# Altium project riglab_dynamic_scales_wifi_3ch.PrjPcb (part 1 of 2)
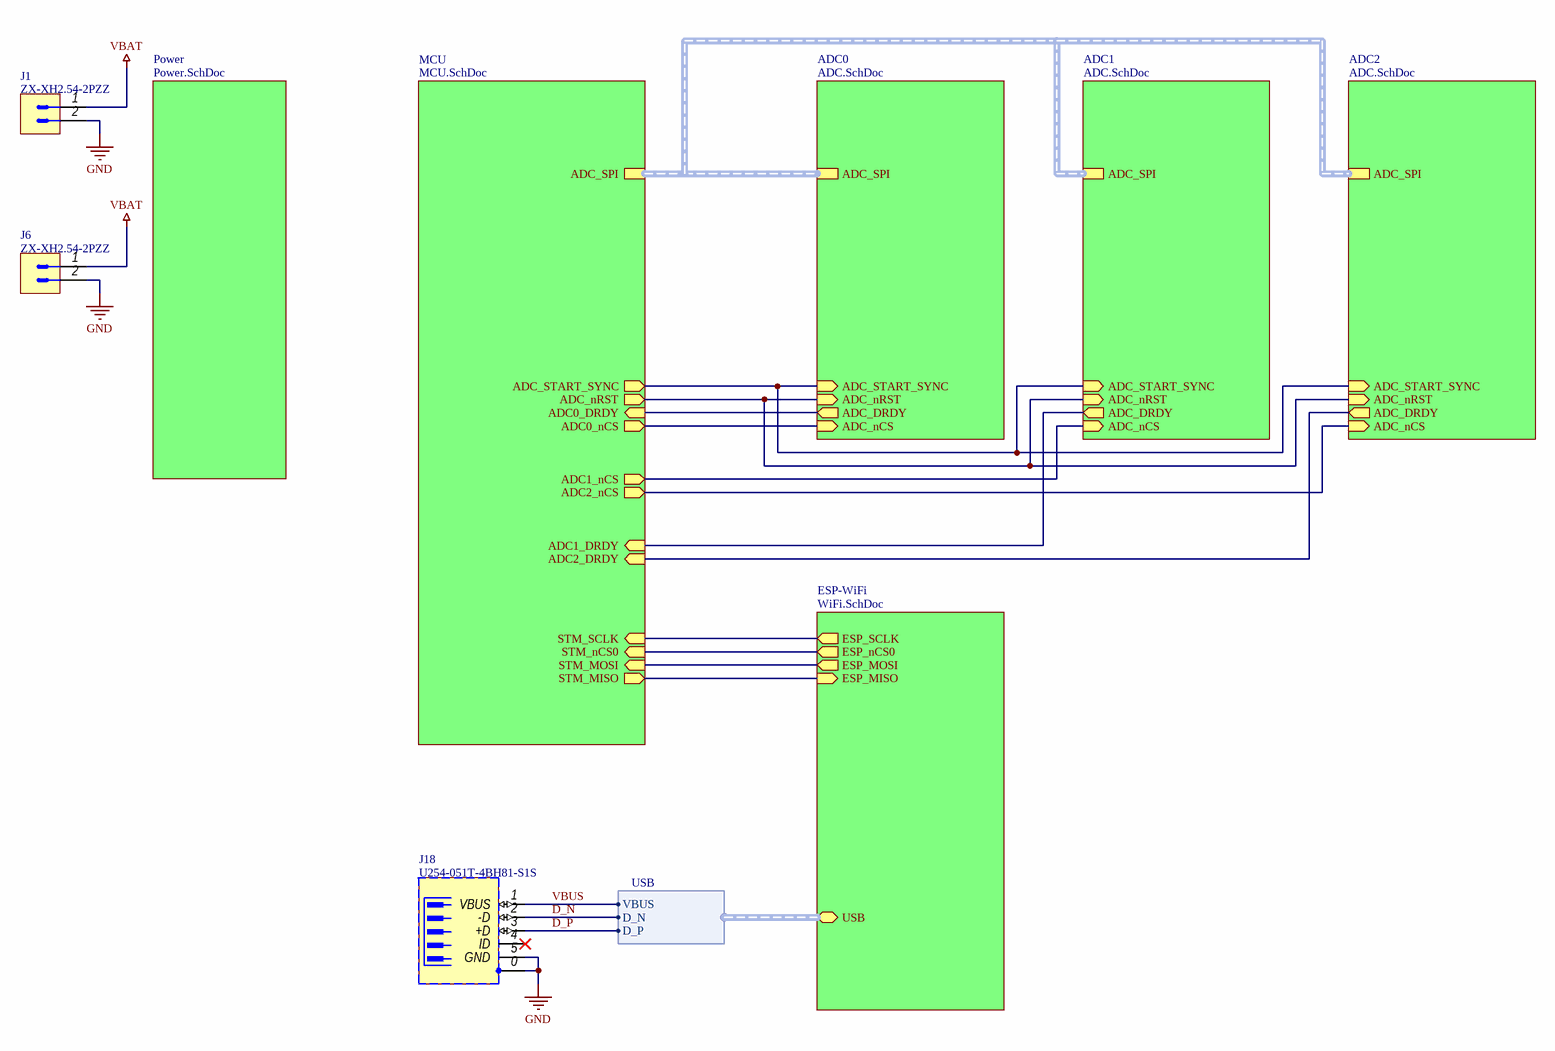
[diagram p0: Main.SchDoc]
Title: riglab_dynamic_scales_wifi_3ch; Project_Name: riglab_dynamic_scales_wifi_3ch; ProjectName: riglab_dynamic_scales_wifi_3ch; Project: riglab_dynamic_scales_wifi_3ch; Company_Name: RIGLAB-XYZ; BoardName: riglab_dynamic_scales_wifi_3ch; Author: Vitaliy Krepak
5 sheets, 252 parts. Net scope: hierarchical (ports join the sheet entries above them; power ports are global).
Board file: riglab_dynamic_scales_wifi_3ch .PcbDoc
Sheets:
  Main.SchDoc
    Power = Power.SchDoc
    MCU = MCU.SchDoc
    ESP-WiFi = WiFi.SchDoc
    ADC0 = ADC.SchDoc
    ADC1 = ADC.SchDoc
    ADC2 = ADC.SchDoc

## Sheet Main.SchDoc: riglab_dynamic_scales_wifi_3ch
size 420 x 297 mm; DocumentNumber: 1; SheetNumber: 1; SheetTotal: 5; Обозначение_Код: RIG-00.00.001 Э3; Наименование1: Аппаратный модуль; Наименование3: РИГЛАБ; Наименование_организации: ООО "Риглаб"; п_Разраб_Р: Крепак В.; Вид_документа_SCH: Схема электрическая принципиальная; Дата_Разраб: 31.10.2025

### Parts
J1  ZX-XH2.54-2PZZ  [XH2.54-2PZZ]
J6  ZX-XH2.54-2PZZ  [XH2.54-2PZZ]
J18  U254-051T-4BH81-S1S  [U254-051T-4BH81-S1S]

### Sub-sheets
ADC0 = ADC.SchDoc: ADC_nRST (in), ADC_START_SYNC (in), ADC_nCS (in), ADC_DRDY (out), ADC_SPI (harness ADC_SPI)
ADC1 = ADC.SchDoc: ADC_nRST (in), ADC_START_SYNC (in), ADC_nCS (in), ADC_DRDY (out), ADC_SPI (harness ADC_SPI)
ADC2 = ADC.SchDoc: ADC_nRST (in), ADC_START_SYNC (in), ADC_nCS (in), ADC_DRDY (out), ADC_SPI (harness ADC_SPI)
ESP-WiFi = WiFi.SchDoc: ESP_SCLK (out), ESP_nCS0 (out), ESP_MOSI (out), ESP_MISO (in), USB (bidir, harness USB)
MCU = MCU.SchDoc: STM_SCLK (in), STM_nCS0 (in), STM_MOSI (in), STM_MISO (out), ADC_nRST (out), ADC_START_SYNC (out), ADC0_nCS (out), ADC0_DRDY (in), ADC_SPI (harness ADC_SPI), ADC1_nCS (out), ADC2_nCS (out), ADC1_DRDY (in), ADC2_DRDY (in)
Power = Power.SchDoc: no entries

### Harnesses
USB: D_N, D_P, VBUS

### Nets
GND: J1.2 J6.2 J18.0(SH) J18.5(GND)
VBAT: J1.1 J6.1
VBUS: J18.1(VBUS) ; sheet ESP-WiFi/USB.VBUS
ADC0_DRDY: sheet MCU/ADC0_DRDY, sheet ADC0/ADC_DRDY
ADC0_nCS: sheet MCU/ADC0_nCS, sheet ADC0/ADC_nCS
ADC1_DRDY: sheet MCU/ADC1_DRDY, sheet ADC1/ADC_DRDY
ADC1_nCS: sheet MCU/ADC1_nCS, sheet ADC1/ADC_nCS
ADC2_DRDY: sheet MCU/ADC2_DRDY, sheet ADC2/ADC_DRDY
ADC2_nCS: sheet MCU/ADC2_nCS, sheet ADC2/ADC_nCS
ADC_nRST: sheet MCU/ADC_nRST, sheet ADC0/ADC_nRST, sheet ADC1/ADC_nRST, sheet ADC2/ADC_nRST
ADC_START_SYNC: sheet MCU/ADC_START_SYNC, sheet ADC0/ADC_START_SYNC, sheet ADC1/ADC_START_SYNC, sheet ADC2/ADC_START_SYNC
D_N: J18.2(-D) ; sheet ESP-WiFi/USB.D_N
D_P: J18.3(+D) ; sheet ESP-WiFi/USB.D_P
ESP_CS0: sheet MCU/STM_nCS0, sheet ESP-WiFi/ESP_nCS0
ESP_MISO: sheet MCU/STM_MISO, sheet ESP-WiFi/ESP_MISO
ESP_MOSI: sheet MCU/STM_MOSI, sheet ESP-WiFi/ESP_MOSI
ESP_SCLK: sheet MCU/STM_SCLK, sheet ESP-WiFi/ESP_SCLK

Not connected (* = marked no-connect by the designer): J18 4(ID)*

### Buses and harness runs
harness sheet ADC0/ADC_SPI = sheet ADC1/ADC_SPI = sheet ADC2/ADC_SPI = sheet MCU/ADC_SPI

### Notes on the sheet
- Перв. примен.
- Справ. №
- Подп. дата
- Инв. № дубл.
- Взам. инв. №
- Подп. и дата
- Изм.
- Разраб.
- Лист
- № докум.
- Подп.
- Дата
- Лит.
- Масса
- Масштаб
- Пров.
- Т.контр.
- Листов
- Инв. № подл.
- Н.контр.
- Утв.
- ALTIUM GOSTBOM2.0 KEV
- Файл:
- Копировал
- Формат А3

### Library data of the parts
J1 J6 = ZX-XH2.54-2PZZ: 1x2P XH 1 2.54mm Tin Male pin 2 260℃ -25℃~+85℃ Brass 3A Straight Plugin,P=2.54mm Wire To Board / Wire To Wire Connector ROHS; ID: 48; Table: Connectors - Общ; Part Number: ZX-XH2.54-2PZZ; Device: ZX-XH2.54-2PZZ; Type: Connector; SMD: No; Status: Active; Price: 0; Price2: 0; Price3: 0; Author: Krepak V.; CreateDate: 19.02.2024
J18 = U254-051T-4BH81-S1S: USB 2.0 1.8A 1 260℃ Surface Mount，Right Angle 5P Female -40℃~+85℃ Gold Copper Alloy Micro-B SMD USB Connectors ROHS; ID: 34; Table: Connectors - Интерфейсы; Part Number: U254-051T-4BH81-S1S; Device: U254-051T-4BH81-S1S; Series: U254-051T-4BH81-S1S; Type: Connector; Price: 0; Price2: 0; Price3: 0; Author: Krepak V.; CreateDate: 09.04.2024

## Sheet Power.SchDoc: riglab_dynamic_scales_wifi_3ch
size 420 x 297 mm; DocumentNumber: 2; SheetNumber: 2; SheetTotal: 5; Обозначение_Код: RIG-00.00.001 Э3
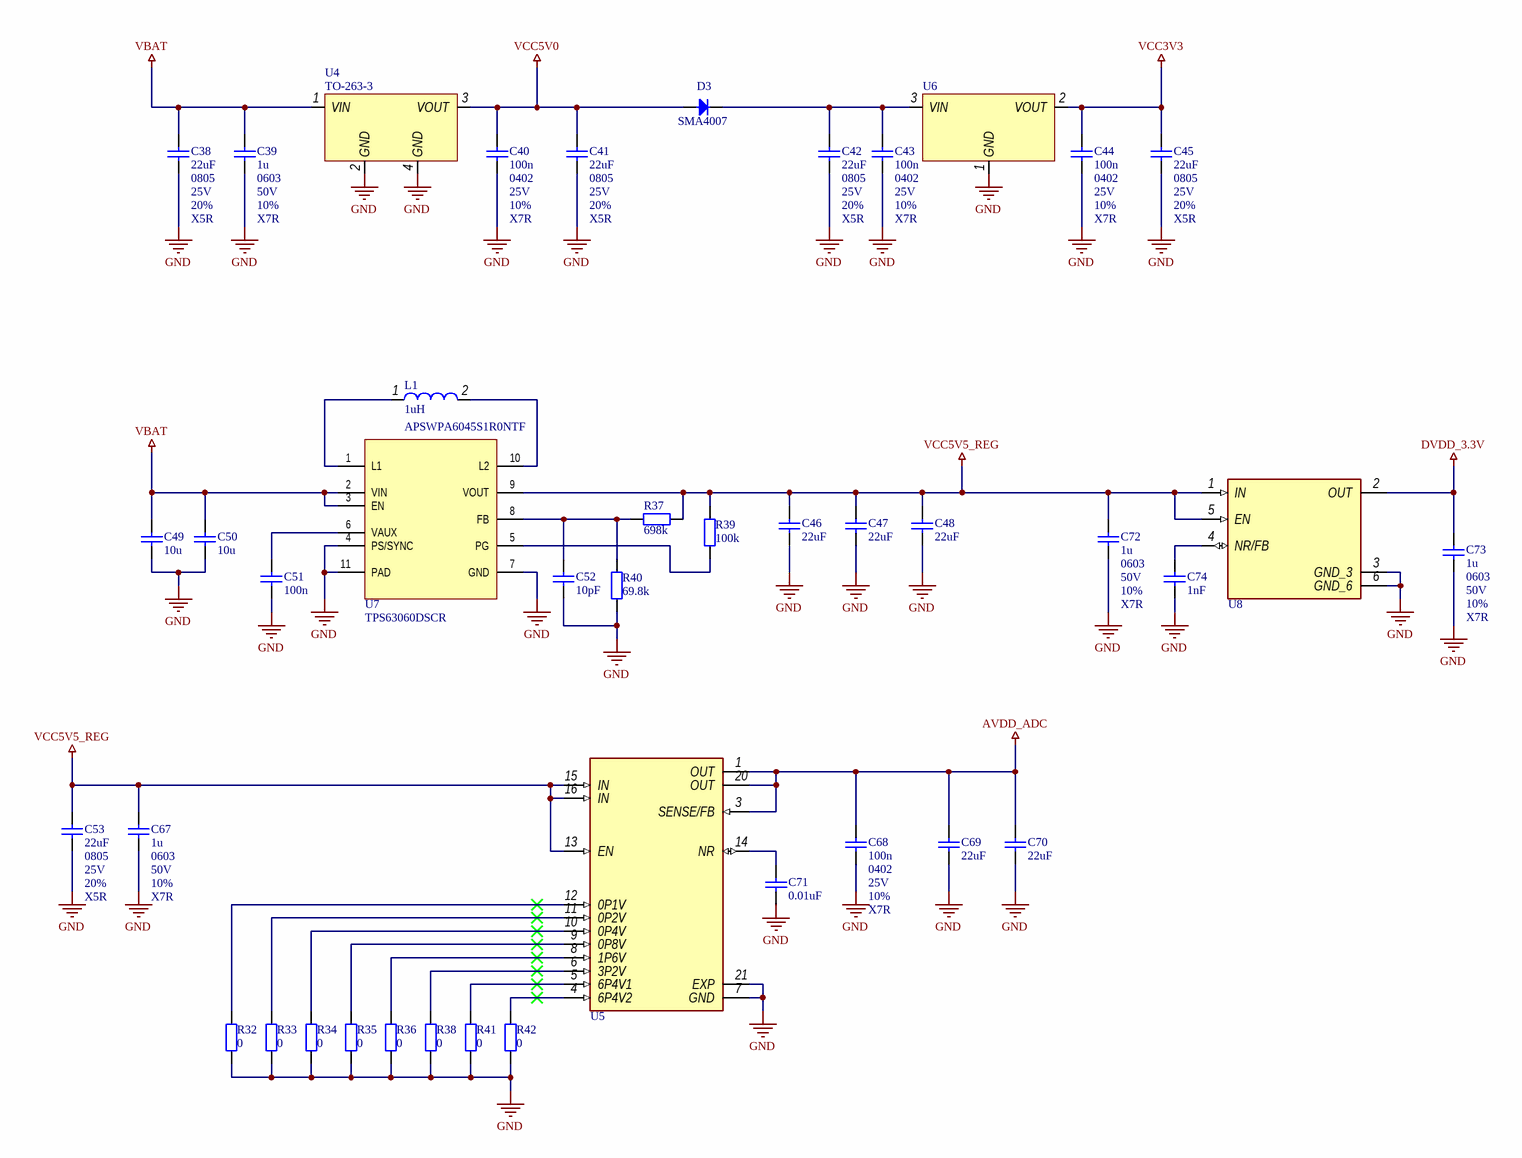
[diagram p1: Power.SchDoc]

### Parts
C38  22uF  Device: 0805  Voltage: 25V  Tolerance: 20%  Dielectric Type: X5R  [CAPC2012X135N]
C39  1u  Device: 0603  Voltage: 50V  Tolerance: 10%  Dielectric Type: X7R  [CAPC1608X85N]
C40  100n  Device: 0402  Voltage: 25V  Tolerance: 10%  Dielectric Type: X7R  [CAPC1005X55N]
C41  22uF  Device: 0805  Voltage: 25V  Tolerance: 20%  Dielectric Type: X5R  [CAPC2012X135N]
C42  22uF  Device: 0805  Voltage: 25V  Tolerance: 20%  Dielectric Type: X5R  [CAPC2012X135N]
C43  100n  Device: 0402  Voltage: 25V  Tolerance: 10%  Dielectric Type: X7R  [CAPC1005X55N]
C44  100n  Device: 0402  Voltage: 25V  Tolerance: 10%  Dielectric Type: X7R  [CAPC1005X55N]
C45  22uF  Device: 0805  Voltage: 25V  Tolerance: 20%  Dielectric Type: X5R  [CAPC2012X135N]
C46  22uF  [CAPC2012X135N]
C47  22uF  [CAPC2012X135N]
C48  22uF  [CAPC2012X135N]
C49  10u  [CAPC2012X135N]
C50  10u  [CAPC2012X135N]
C51  100n  [CAPC1005X55N]
C52  10pF  [CAPC1005X55N]
C53  22uF  Device: 0805  Voltage: 25V  Tolerance: 20%  Dielectric Type: X5R  [CAPC2012X135N]
C67  1u  Device: 0603  Voltage: 50V  Tolerance: 10%  Dielectric Type: X7R  [CAPC1608X85N]
C68  100n  Device: 0402  Voltage: 25V  Tolerance: 10%  Dielectric Type: X7R  [CAPC1005X55N]
C69  22uF  [CAPC2012X135N]
C70  22uF  [CAPC2012X135N]
C71  0.01uF  [CAPC1005X55N]
C72  1u  Device: 0603  Voltage: 50V  Tolerance: 10%  Dielectric Type: X7R  [CAPC1608X85N]
C73  1u  Device: 0603  Voltage: 50V  Tolerance: 10%  Dielectric Type: X7R  [CAPC1608X85N]
C74  1nF  [CAPC1005X55N]
D3  SMA4007  [DO-214AC]
L1  1uH  Part Number: APSWPA6045S1R0NTF  [APSWPA6045]
R32  0  [RESC1608X50N]
R33  0  [RESC1608X50N]
R34  0  [RESC1608X50N]
R35  0  [RESC1608X50N]
R36  0  [RESC1608X50N]
R37  698k  [RESC1005X40N]
R38  0  [RESC1608X50N]
R39  100k  [RESC1005X40N]
R40  69.8k  [RESC1005X40N]
R41  0  [RESC1608X50N]
R42  0  [RESC1608X50N]
U4  value TO-263-3  [TO-263-3_L8.6-W10.2-P2.54-LS14.4-BR]  (hidden comment: LM7805S)
U5  TPS7A4700RGWR  [QFN65P500X500X100-21N]  (value not drawn)
U6  AMS1117-3.3  [SOT230P700-4BN]  (value not drawn)
U7  TPS63060DSCR  [WSON10]
U8  TPS73733DCQR  [IC_TPS73733DCQR]  (value not drawn)

### Nets
AVDD_ADC: C68.2 C69.2 C70.2 U5.1(OUT) U5.3(SENSE/FB) U5.20(OUT)
DVDD_3.3V: C73.2 U8.2(OUT)
GND: C38.1 C39.1 C40.1 C41.1 C42.1 C43.1 C44.1 C45.1 C46.1 C47.1 C48.1 C49.1 C50.1 C51.1 C52.1 C53.1 C67.1 C68.1 C69.1 C70.1 C71.1 C72.1 C73.1 C74.1 R32.1 R33.1 R34.1 R35.1 R36.1 R38.1 R40.1 R41.1 R42.1 U4.2(GND) U4.4(GND) U5.7(GND) U5.21(EXP) U6.1(GND) U7.4(PS/SYNC) U7.7(GND) U7.11(PAD) U8.3(GND_3) U8.6(GND_6)
VBAT: C38.2 C39.2 C49.2 C50.2 U4.1(VIN) U7.2(VIN) U7.3(EN)
VCC3V3: C44.2 C45.2 U6.2(VOUT)
VCC5V0: C40.2 C41.2 D3.1(A) U4.3(VOUT)
VCC5V5_REG: C46.2 C47.2 C48.2 C53.2 C67.2 C72.2 R37.2 R39.2 U5.13(EN) U5.15(IN) U5.16(IN) U7.9(VOUT) U8.1(IN) U8.5(EN)
NetC42_2: C42.2 C43.2 D3.2(C) U6.3(VIN)
NetC51_2: C51.2 U7.6(VAUX)
NetC52_2: C52.2 R37.1 R40.2 U7.8(FB)
NetC71_2: C71.2 U5.14(NR)
NetC74_2: C74.2 U8.4(NR/FB)
NetL1_1: L1.1 U7.1(L1)
NetL1_2: L1.2 U7.10(L2)
NetR32_2: R32.2 U5.12(0P1V)
NetR33_2: R33.2 U5.11(0P2V)
NetR34_2: R34.2 U5.10(0P4V)
NetR35_2: R35.2 U5.9(0P8V)
NetR36_2: R36.2 U5.8(1P6V)
NetR38_2: R38.2 U5.6(3P2V)
NetR39_1: R39.1 U7.5(PG)
NetR41_2: R41.2 U5.5(6P4V1)
NetR42_2: R42.2 U5.4(6P4V2)

### Notes on the sheet
- Подп. дата
- Инв. № дубл.
- Взам. инв. №
- Подп. и дата
- Инв. № подл.
- Изм.
- Лист
- № докум.
- Подп.
- Дата
- ALTIUM GOSTBOM2.0 KEV
- Файл:
- Копировал
- Формат А3

### Library data of the parts
C38 C41 C42 C45 C53 = GRM21BR61E226ME44L: CAP CER 0805 22uF 25V X5R; Manufacturer: Murata; ID: 21; Type: Resistor; Packaging Type: Cut Tape; Working Temperature Min: -55°С; Working Temperature Max: +125°С; Table: Capacitor SMT - Керамические; Part Number: GRM21BR61E226ME44L; Value: 22uF; Series: GRM; SMD: Yes; Manufacturer Part Number: GRM21BR61E226ME44L; Datasheet URL: #https://www.terraelectronica.ru/pdf/show?pdf_file=http%253A%252F%252Fwww.farnell.com%252Fdatasheets%252F2048737.pdf#; Status: Active; Price: 0; Price2: 0; Price3: 0; Author: Arshanitsa D.; CreateDate: 17.08.2020
C39 C67 C72 C73 = CC0603KRX7R9BB105: CAP CER 0603 1u 50V X7R; Manufacturer: Yageo; ID: 12; Type: Resistor; Packaging Type: Cut Tape; Working Temperature Min: -55°С; Working Temperature Max: +125°С; Table: Capacitor SMT - Керамические; Part Number: CC0603KRX7R9BB105; Value: 1u; Series: CC; SMD: Yes; Manufacturer Part Number: CC0603KRX7R9BB105; Datasheet URL: #https://www.terraelectronica.ru/pdf/show?pdf_file=http%253A%252F%252Fwww.mouser.com%252Fds%252F2%252F447%252FUPY-GPHC_X7R_6.3V-to-50V_18-1154002.pdf#; Status: Active; Price: 0; Price2: 0; Price3: 0; Author: Krepak V.; CreateDate: 06.04.2020
C40 C43 C44 C68 = GRM155R71E104KE14D: CAP CER 0402 100n 25V X7R; Manufacturer: Murata; ID: 4; Type: Resistor; Packaging Type: Cut Tape; Working Temperature Min: -55°С; Working Temperature Max: +125°С; Table: Capacitor SMT - Керамические; Part Number: GRM155R71E104KE14D; Value: 100n; Series: GRM; SMD: Yes; Manufacturer Part Number: GRM155R71E104KE14D; Status: Active; Price: 0; Price2: 0; Price3: 0; Author: Krepak V.; CreateDate: 23.02.2020
C46-C48 C69 C70 = GRM21BR61E226ME44L: CAP CER 0805 22uF 25V X5R; Manufacturer: Murata; ID: 21; Device: 0805; Tolerance: 20%; Type: Resistor; Packaging Type: Cut Tape; Working Temperature Min: -55°С; Working Temperature Max: +125°С; Table: Capacitor SMT - Керамические; Part Number: GRM21BR61E226ME44L; Value: 22uF; Voltage: 25V; Dielectric Type: X5R; Series: GRM; SMD: Yes; Manufacturer Part Number: GRM21BR61E226ME44L; Datasheet URL: #https://www.terraelectronica.ru/pdf/show?pdf_file=http%253A%252F%252Fwww.farnell.com%252Fdatasheets%252F2048737.pdf#; Status: Active; Price: 0; Price2: 0; Price3: 0; Author: Arshanitsa D.; CreateDate: 17.08.2020
C49 C50 = GRM21BZ71E106KE15L: CAP CER 0805 10u 25V X7R; Manufacturer: Murata; ID: 5; Device: 0805; Tolerance: 10%; Type: Resistor; Packaging Type: Cut Tape; Working Temperature Min: -55°С; Working Temperature Max: +125°С; Table: Capacitor SMT - Керамические; Part Number: GRM21BZ71E106KE15L; Value: 10u; Voltage: 25V; Dielectric Type: X7R; Series: GRM; SMD: Yes; Manufacturer Part Number: GRM21BZ71E106KE15L; Status: Active; Price: 0; Price2: 0; Price3: 0; Author: Krepak V.; CreateDate: 23.02.2020
C51 = GRM155R71E104KE14D: CAP CER 0402 100n 25V X7R; Manufacturer: Murata; ID: 4; Device: 0402; Tolerance: 10%; Type: Resistor; Packaging Type: Cut Tape; Working Temperature Min: -55°С; Working Temperature Max: +125°С; Table: Capacitor SMT - Керамические; Part Number: GRM155R71E104KE14D; Value: 100n; Voltage: 25V; Dielectric Type: X7R; Series: GRM; SMD: Yes; Manufacturer Part Number: GRM155R71E104KE14D; Status: Active; Price: 0; Price2: 0; Price3: 0; Author: Krepak V.; CreateDate: 23.02.2020
C52 = CC0402JRNPO9BN100: CAP CER 0402 10pF 50V NP0; Manufacturer: Yageo; ID: 55; Device: 0402; Tolerance: 5%; Type: Resistor; Packaging Type: Tape&Reel; Working Temperature Min: -55°С; Working Temperature Max: +125°С; Table: Capacitor SMT - Керамические; Part Number: CC0402JRNPO9BN100; Value: 10pF; Voltage: 50V; Dielectric Type: NP0; Series: CC; SMD: Yes; Manufacturer Part Number: CC0402JRNPO9BN100; Datasheet URL: #https://www.yageo.com/upload/media/product/productsearch/datasheet/mlcc/UPY-GP_NP0_16V-to-50V_18.pdf#; Status: Not recommended; Price: 0; Price2: 0; Price3: 0; Author: Krepak V.; CreateDate: 22.06.2021; Supplier 1: Digikey; Supplier Part Number 1: 311-1014-2-ND
C71 = CC0402KRX7R8BB103: CAP CER 0402 0.01uF 25V X7R; Manufacturer: Yageo; ID: 65; Device: 0402; Tolerance: ±10%; Type: Resistor; Packaging Type: Tape&Reel; Working Temperature Min: -55°С; Working Temperature Max: +125°С; Table: Capacitor SMT - Керамические; Part Number: CC0402KRX7R8BB103; Value: 0.01uF; Voltage: 25V; Dielectric Type: X7R; Series: CC; SMD: Yes; Manufacturer Part Number: CC0402KRX7R8BB103; Datasheet URL: #https://www.yageo.com/upload/media/product/productsearch/datasheet/mlcc/UPY-GPHC_X7R_6.3V-to-50V_18.pdf#; Status: Active; Price: 0; Price2: 0; Price3: 0; Author: Krepak V.; CreateDate: 24.06.2021; Supplier 1: Digikey; Supplier Part Number 1: 311-1337-2-ND
C74 = C1005C0G1H102JT000F: CAP CER 0402 1nF 50V NP0; Manufacturer: TDK Corporation; ID: 67; Device: 0402; Tolerance: 5%; Type: Resistor; Packaging Type: Tape&Reel; Working Temperature Min: -55°С; Working Temperature Max: +125°С; Table: Capacitor SMT - Керамические; Part Number: C1005C0G1H102JT000F; Value: 1nF; Voltage: 50V; Dielectric Type: NP0; SMD: Yes; Manufacturer Part Number: C1005C0G1H102JT000F; Status: Active; Price: 0; Price2: 0; Price3: 0; Author: Krepak V.; CreateDate: 19.02.2024
D3 = SMA4007: DIODE SMA4007; Manufacturer: Wing Shing; ID: 1; Value: 1000V; Max Reverse Voltage: 1000VDC; Average Current: 1A; Forward Voltage: 1.1V @ 1.0A DC; Peak Pulse Current: 30A; Reverse Leakage Current: 5uA @ 25°С 1000V; Speed: Standard Recovery; Capacitance: 15pF @ 4V, 1MHz; Reverse Recovery Time: 2.5µs; Packaging Type: Cut Tape; Replacement: 1N4007FLTR, M7, S1MB-13; Working Temperature Min: -65°С; Working Temperature Max: +165°С (JT); Table: Diodes SMT - Общ; Part Number: SMA4007; Device: SMA4007; Type: Diode; SMD: Yes; Manufacturer Part Number: SMA4007; ComponentHeight: 0.96mm; Datasheet URL: #http://pdf.datasheet.live/c12a47ed/wingshing.com/SMA4007.pdf#; Status: Active; Distributor: Chipdip; Price: 0; Price2: 0; Price3: 0; DistributorURL: #https://www.chipdip.ru/product/sma4007#; Author: Krepak V.; CreateDate: 24.06.2020; LatestRevisionDate: 24.06.2020
L1 = APSWPA6045S1R0NTF: IND APSWPA6045S1R0NTF 1uH ±30%; Manufacturer: APV; ID: 16; Self Resonant: 100MHz; Rated Current: 5,6A; DC Resistance: 14mOhm Max; Inductor Type: Wirewound; Type: Inductor; Packaging Type: Tape&Reel; Working Temperature Min: -40°C; Working Temperature Max: +125°C; Table: Inductors SMT - Общ; Device: APSWPA6045S1R0NTF; Value: 1uH; Tolerance: ±30%; Series: APSWPA; SMD: Yes; Manufacturer Part Number: APSWPA6045S1R0NTF; Datasheet URL: #https://jlcpcb.com/partdetail/Apv-APSWPA6045S1R0NTF/C5363709#; Datasheet Version: 2023/03/10; Status: Active; Price: 0; Price2: 0; Price3: 0; Author: Krepak V.; CreateDate: 22.02.2024
R32-R36 R38 R41 R42 = RC0603JR-070RL: RES 0603 0 5%; Manufacturer: Yageo; ID: 25; Device: 0603; Limit Voltage: 50V; Temperature Coefficient: 100ppm; Total Power Dissipation: 0.063W; Packaging Type: Cut Tape; Library Ref 2: Resistor2; Library Ref 3: Resistor3; Library Path 2: Resistors.SchLib; Application Category: 1; Working Temperature Min: -55°С; Working Temperature Max: +155°С; Table: Resistor SMT - Постоянные; Part Number: RC0603JR-070RL; Value: 0; Tolerance: 5%; Series: RC; Type: Resistor; Material: Thick-Film; SMD: Yes; Manufacturer Part Number: RC0603JR-070RL; Datasheet URL: #https://static.chipdip.ru/lib/788/DOC004788200.pdf#; Status: Active; Price: 0; Price2: 0; Price3: 0; Author: Arshanitsa D.; CreateDate: 28.06.2020
R37 = RC0402FR-07698KL: RES 0402 698k 1%; Manufacturer: Yageo; ID: 109; Device: 0402; Limit Voltage: 50V; Temperature Coefficient: 100ppm; Total Power Dissipation: 0.0625W; Packaging Type: Cut Tape; Library Ref 2: Resistor2; Library Ref 3: Resistor3; Library Path 2: Resistors.SchLib; Application Category: 1; Working Temperature Min: -55°С; Working Temperature Max: +155°С; Table: Resistor SMT - Постоянные; Part Number: RC0402FR-07698KL; Value: 698k; Tolerance: 1%; Series: RC; Type: Resistor; Material: Thick-Film; SMD: Yes; Manufacturer Part Number: RC0402FR-07698KL; Status: Active; Price: 0; Price2: 0; Price3: 0; Author: Krepak V.; CreateDate: 09.04.2024
R39 = RC0402FR-07100KL: RES 0402 100k 1%; Manufacturer: Yageo; ID: 2; Device: 0402; Limit Voltage: 50V; Temperature Coefficient: 100ppm; Total Power Dissipation: 0.0625W; Packaging Type: Cut Tape; Library Ref 2: Resistor2; Library Ref 3: Resistor3; Library Path 2: Resistors.SchLib; Application Category: 1; Working Temperature Min: -55°С; Working Temperature Max: +155°С; Table: Resistor SMT - Постоянные; Part Number: RC0402FR-07100KL; Value: 100k; Tolerance: 1%; Series: RC; Type: Resistor; Material: Thick-Film; SMD: Yes; Price: 0; Price2: 0; Price3: 0; Author: Krepak V.; CreateDate: 23.02.2020
R40 = RC0402FR-0769K8L: RES 0402 69.8k 1%; Manufacturer: Yageo; ID: 107; Device: 0402; Limit Voltage: 75V; Temperature Coefficient: 100ppm; Total Power Dissipation: 0.0625W; Packaging Type: Tape&Reel; Library Ref 2: Resistor2; Library Ref 3: Resistor3; Library Path 2: Resistors.SchLib; Application Category: 1; Working Temperature Min: -55°С; Working Temperature Max: +155°С; Table: Resistor SMT - Постоянные; Part Number: RC0402FR-0769K8L; Value: 69.8k; Tolerance: 1%; Series: 0.0625W; Type: Resistor; Material: Thick-Film; SMD: Yes; Manufacturer Part Number: RC0402FR-0769K8L; Status: Active; Price: 0; Price2: 0; Price3: 0; Author: Krepak V.; CreateDate: 22.02.2024
U4 = LM7805S/TR: TO-263-3 Linear Voltage Regulators (LDO) ROHS; ID: 44; Table: IC - Преобразователи и модули питания; Part Number: LM7805S/TR; Device: LM7805S; Type: IC; SMD: Yes; Status: Active; Price: 0; Price2: 0; Price3: 0; Author: Krepak V.; CreateDate: 19.02.2024
U5 = TPS7A4700RGWR: 1-A, 36-V, low-noise, high-PSRR, low-dropout voltage regulator with enable 20-VQFN -40 to 125; MF: Texas Instruments; ID: 48; Table: IC - Преобразователи и модули питания; SnapEDA_Link: https://www.snapeda.com/parts/TPS7A4700RGWR/Texas%20Instruments/view-part/424142/?ref=snap; Availability: Good; Purchase-URL: https://pricing.snapeda.com/search/part/TPS7A4700RGWR/?ref=eda; Package: VQFN-20 Texas Instruments; Price: 0; MP: TPS7A4700RGWR; Part Number: TPS7A4700RGWR; Device: TPS7A4700RGWR; Type: IC; SMD: Yes; Price2: 0; Price3: 0; Author: Krepak V.; CreateDate: 05.04.2024
U6 = AMS1117-3.3: ID: 25; Table: IC - Преобразователи и модули питания; Part Number: AMS1117-3.3; Device: AMS1117-3.3; Type: IC; SMD: Yes; Price: 0; Price2: 0; Price3: 0
U7 = TPS63060DSCR: Buck-boost type Adjustable 2.5V~8V 2A 2.5V~12V DFN-10(3x3) DC-DC Converters ROHS; Manufacturer: Texas Instruments; ID: 46; Value: WSON (10); Input Voltage: 2.5 V to 12 V; Number of Outputs: 1; Operation Frequency: 2.4 MHz; Packaging Type: Tape&Reel; Working Temperature Min: -40°C; Working Temperature Max: +85°C; Table: IC - Преобразователи и модули питания; Part Number: TPS63060DSCR; Device: TPS63060DSCR; Function: Buck-Boost; Topology: Buck-Boost; Type: IC; SMD: Yes; Manufacturer Part Number: TPS63060DSCR; Datasheet Version: https://www.ti.com/lit/ds/symlink/tps63060.pdf?HQS=dis-dk-null-digikeymode-dsf-pf-null-wwe&ts=1708584012537&ref_url=https%253A%252F%252Fwww.ti.com%252Fgeneral%252Fdocs%252Fsuppproductinfo.tsp%253FdistId%253D10%2526gotoUrl%253Dhttps%253A%252F%252Fwww.ti.com%252Flit%252Fgpn%252Ftps63060; Status: Active; Price: 0; Price2: 0; Price3: 0; Author: Krepak V.; CreateDate: 22.02.2024
U8 = TPS73733DCQR: 1-A, ultra-low-dropout voltage regulator with reverse current protection & enable 6-SOT-223 -40 to 125; ID: 49; Table: IC - Преобразователи и модули питания; Price: 0; Availability: Unavailable; MP: TPS73733DCQR; Package: None; Part Number: TPS73733DCQR; Device: TPS73733DCQR; Type: IC; SMD: Yes; Price2: 0; Price3: 0; Author: Krepak V.; CreateDate: 05.04.2024

## Sheet MCU.SchDoc: riglab_dynamic_scales_wifi_3ch
size 420 x 297 mm; DocumentNumber: 4; SheetNumber: 4; SheetTotal: 5; Обозначение_Код: RIG-00.00.001 Э3
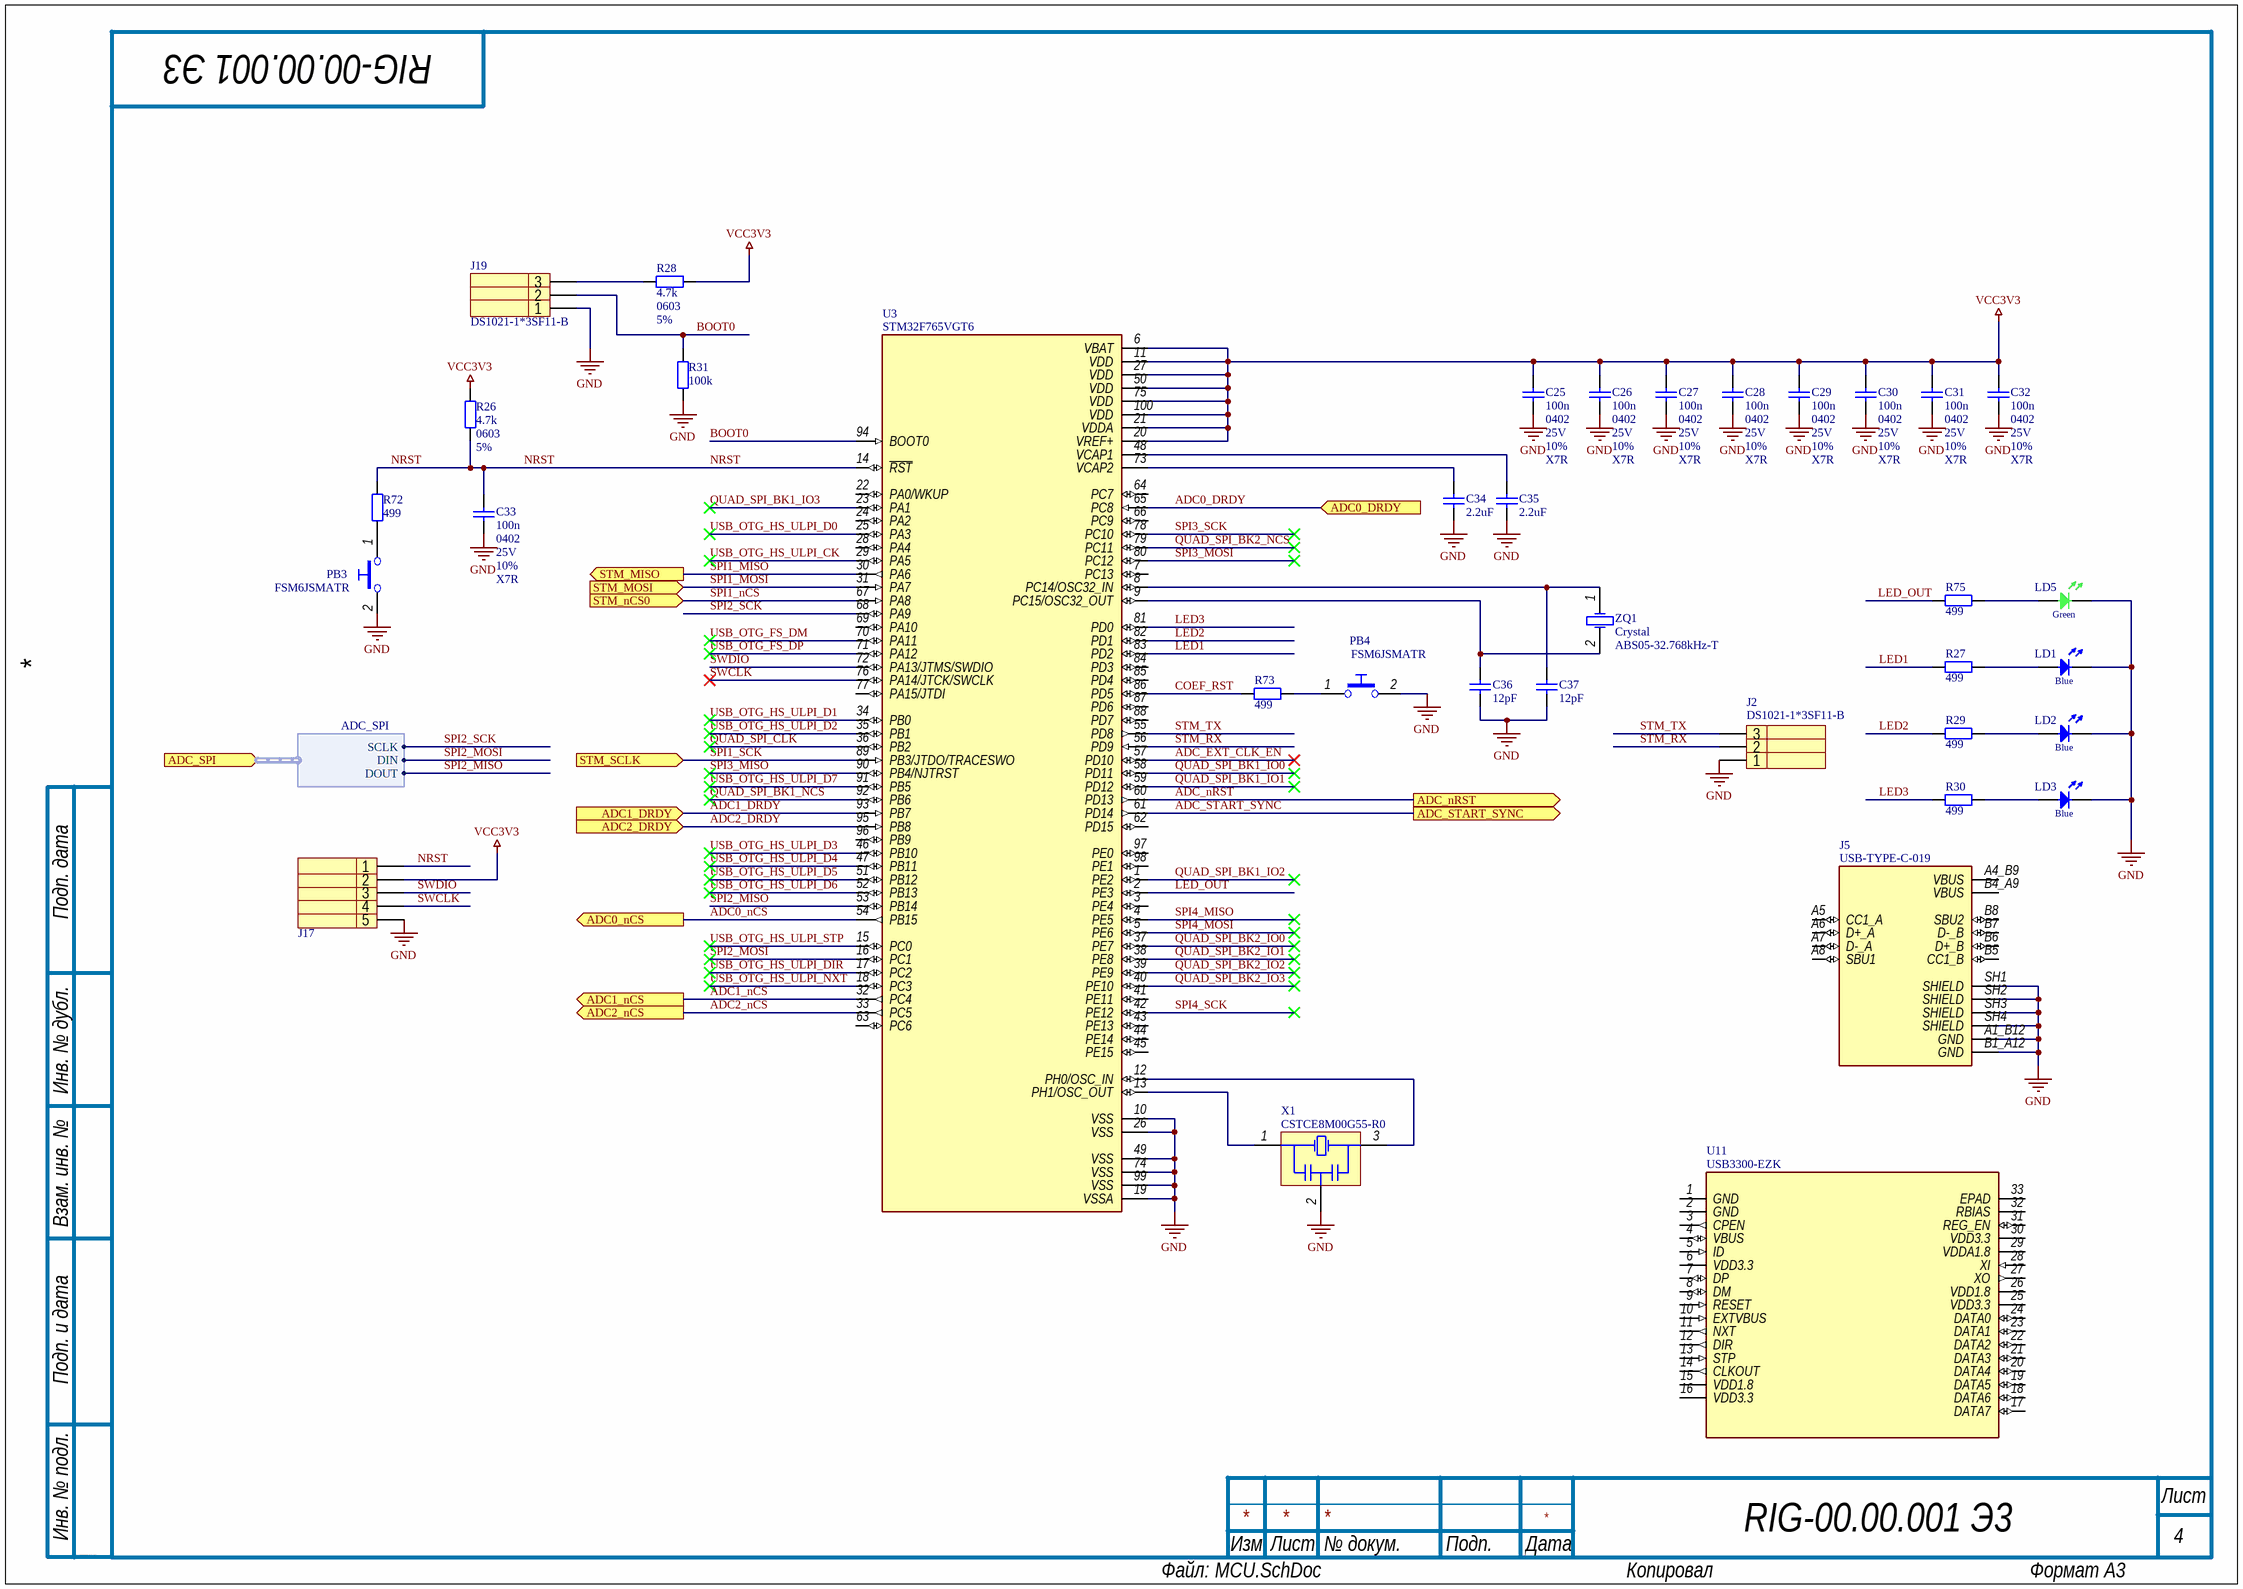
[diagram p2: MCU.SchDoc]

### Parts
C25  100n  Device: 0402  Voltage: 25V  Tolerance: 10%  Dielectric Type: X7R  [CAPC1005X55N]
C26  100n  Device: 0402  Voltage: 25V  Tolerance: 10%  Dielectric Type: X7R  [CAPC1005X55N]
C27  100n  Device: 0402  Voltage: 25V  Tolerance: 10%  Dielectric Type: X7R  [CAPC1005X55N]
C28  100n  Device: 0402  Voltage: 25V  Tolerance: 10%  Dielectric Type: X7R  [CAPC1005X55N]
C29  100n  Device: 0402  Voltage: 25V  Tolerance: 10%  Dielectric Type: X7R  [CAPC1005X55N]
C30  100n  Device: 0402  Voltage: 25V  Tolerance: 10%  Dielectric Type: X7R  [CAPC1005X55N]
C31  100n  Device: 0402  Voltage: 25V  Tolerance: 10%  Dielectric Type: X7R  [CAPC1005X55N]
C32  100n  Device: 0402  Voltage: 25V  Tolerance: 10%  Dielectric Type: X7R  [CAPC1005X55N]
C33  100n  Device: 0402  Voltage: 25V  Tolerance: 10%  Dielectric Type: X7R  [CAPC1005X55N]
C34  2.2uF  [CAPC1005X55N]
C35  2.2uF  [CAPC1005X55N]
C36  12pF  [CAPC1005X55N]
C37  12pF  [CAPC1005X55N]
J2  DS1021-1*3SF11-B  [PLS-3]
J5  USB-TYPE-C-019  [AMPHENOL_12402012E212A]
J17  DS1021-1*5SF11-B  [PLS-5]  (value not drawn)
J19  DS1021-1*3SF11-B  [PLS-3]
LD1  Blue  [0603(LED_B)]  (value not drawn)
LD2  Blue  [0603(LED_B)]  (value not drawn)
LD3  Blue  [0603(LED_B)]  (value not drawn)
LD5  Green  [LD-3mm-G]  (value not drawn)
PB3  FSM6JSMATR  [FSMxJSMA-Series]
PB4  FSM6JSMATR  [FSMxJSMA-Series]
R26  4.7k  Device: 0603  Tolerance: 5%  [RESC1608X50N]
R27  499  [RESC1005X40N]
R28  4.7k  Device: 0603  Tolerance: 5%  [RESC1608X50N]
R29  499  [RESC1005X40N]
R30  499  [RESC1005X40N]
R31  100k  [RESC1005X40N]
R72  499  [RESC1005X40N]
R73  499  [RESC1005X40N]
R75  499  [RESC1005X40N]
U3  STM32F765VGT6  [LQFP100_L]
U11  USB3300-EZK  [QFN32_5X5MC_MCH]
X1  CSTCE8M00G55-R0  [MURA-CSTCE_G_A-3_V]
ZQ1  Crystal  Part Number: ABS05-32.768kHz-T  [FP-ABS05-MFG]

### Ports
ADC0_DRDY (in), ADC0_nCS (out), ADC1_DRDY (in), ADC1_nCS (out), ADC2_DRDY (in), ADC2_nCS (out), ADC_nRST (out), ADC_SPI (in, harness ADC_SPI), ADC_START_SYNC (out), STM_MISO (out), STM_MOSI (in), STM_nCS0 (in), STM_SCLK (in)

### Harnesses
ADC_SPI: DIN, DOUT, SCLK

### Nets
GND: C25.1 C26.1 C27.1 C28.1 C29.1 C30.1 C31.1 C32.1 C33.1 C34.1 C35.1 C36.1 C37.1 J2.1 J5.A1_B12(GND) J5.B1_A12(GND) J5.SH1(SHIELD) J5.SH2(SHIELD) J5.SH3(SHIELD) J5.SH4(SHIELD) J17.5 J19.1 LD1.2(C) LD2.2(C) LD3.2(C) LD5.2(C) PB3.2 PB4.2 R31.1 U3.10(VSS) U3.19(VSSA) U3.26(VSS) U3.49(VSS) U3.74(VSS) U3.99(VSS) X1.2(GND)
VCC3V3: C25.2 C26.2 C27.2 C28.2 C29.2 C30.2 C31.2 C32.2 J17.2 R26.2 R28.2 U3.6(VBAT) U3.11(VDD) U3.20(VREF+) U3.21(VDDA) U3.27(VDD) U3.50(VDD) U3.75(VDD) U3.100(VDD)
ADC0_DRDY: U3.65(PC8) ; port ADC0_DRDY
ADC0_nCS: U3.54(PB15) ; port ADC0_nCS
ADC1_DRDY: U3.93(PB7) ; port ADC1_DRDY
ADC1_nCS: U3.32(PC4) ; port ADC1_nCS
ADC2_DRDY: U3.95(PB8) ; port ADC2_DRDY
ADC2_nCS: U3.33(PC5) ; port ADC2_nCS
ADC_EXT_CLK_EN: U3.57(PD10)
ADC_nRST: U3.60(PD13) ; port ADC_nRST
ADC_START_SYNC: U3.61(PD14) ; port ADC_START_SYNC
BOOT0: J19.2 R31.2 U3.94(BOOT0)
COEF_RST: R73.2 U3.86(PD5)
LED1: R27.1 U3.83(PD2)
LED2: R29.1 U3.82(PD1)
LED3: R30.1 U3.81(PD0)
LED_OUT: R75.1 U3.2(PE3)
NRST: C33.2 J17.1 R26.1 R72.2 U3.14(~{RST})
QUAD_SPI_BK1_IO0: U3.58(PD11)
QUAD_SPI_BK1_IO1: U3.59(PD12)
QUAD_SPI_BK1_IO2: U3.1(PE2)
QUAD_SPI_BK1_IO3: U3.23(PA1)
QUAD_SPI_BK1_NCS: U3.92(PB6)
QUAD_SPI_BK2_IO0: U3.37(PE7)
QUAD_SPI_BK2_IO1: U3.38(PE8)
QUAD_SPI_BK2_IO2: U3.39(PE9)
QUAD_SPI_BK2_IO3: U3.40(PE10)
QUAD_SPI_BK2_NCS: U3.79(PC11)
QUAD_SPI_CLK: U3.36(PB2)
SPI1_MISO: U3.30(PA6) ; port STM_MISO  [project net ESP_MISO]
SPI1_MOSI: U3.31(PA7) ; port STM_MOSI  [project net ESP_MOSI]
SPI1_nCS: U3.67(PA8) ; port STM_nCS0  [project net ESP_CS0]
SPI1_SCK: U3.89(PB3/JTDO/TRACESWO) ; port STM_SCLK  [project net ESP_SCLK]
SPI2_MISO: U3.53(PB14) ; port ADC_SPI.DOUT  [project net ADC_DOUT]
SPI2_MOSI: U3.16(PC1) ; port ADC_SPI.DIN  [project net ADC_DIN]
SPI2_SCK: U3.68(PA9) ; port ADC_SPI.SCLK  [project net ADC_SCLK]
SPI3_MISO: U3.90(PB4/NJTRST)
SPI3_MOSI: U3.80(PC12)
SPI3_SCK: U3.78(PC10)
SPI4_MISO: U3.4(PE5)
SPI4_MOSI: U3.5(PE6)
SPI4_SCK: U3.42(PE12)
STM_RX: J2.2 U3.56(PD9)
STM_TX: J2.3 U3.55(PD8)
SWCLK: J17.4 U3.76(PA14/JTCK/SWCLK)
SWDIO: J17.3 U3.72(PA13/JTMS/SWDIO)
USB_OTG_FS_DM: U3.70(PA11)
USB_OTG_FS_DP: U3.71(PA12)
USB_OTG_HS_ULPI_CK: U3.29(PA5)
USB_OTG_HS_ULPI_D0: U3.25(PA3)
USB_OTG_HS_ULPI_D1: U3.34(PB0)
USB_OTG_HS_ULPI_D2: U3.35(PB1)
USB_OTG_HS_ULPI_D3: U3.46(PB10)
USB_OTG_HS_ULPI_D4: U3.47(PB11)
USB_OTG_HS_ULPI_D5: U3.51(PB12)
USB_OTG_HS_ULPI_D6: U3.52(PB13)
USB_OTG_HS_ULPI_D7: U3.91(PB5)
USB_OTG_HS_ULPI_DIR: U3.17(PC2)
USB_OTG_HS_ULPI_NXT: U3.18(PC3)
USB_OTG_HS_ULPI_STP: U3.15(PC0)
NetC34_2: C34.2 U3.73(VCAP2)
NetC35_2: C35.2 U3.48(VCAP1)
NetC36_2: C36.2 U3.9(PC15/OSC32_OUT) ZQ1.2(OSC2)
NetC37_2: C37.2 U3.8(PC14/OSC32_IN) ZQ1.1(OSC1)
NetJ19_3: J19.3 R28.1
NetLD1_1: LD1.1(A) R27.2
NetLD2_1: LD2.1(A) R29.2
NetLD3_1: LD3.1(A) R30.2
NetLD5_1: LD5.1(A) R75.2
NetPB3_1: PB3.1 R72.1
NetPB4_1: PB4.1 R73.1
NetU3_12: U3.12(PH0/OSC_IN) X1.3(X2)
NetU3_13: U3.13(PH1/OSC_OUT) X1.1(X1)

Not connected (* = marked no-connect by the designer): J5 A4_B9(VBUS) A5(CC1_A) A6(D+_A) A7(D-_A) A8(SBU1) B4_A9(VBUS) B5(CC1_B) B6(D+_B) B7(D-_B) B8(SBU2); U3 3(PE4) 7(PC13) 22(PA0/WKUP) 24(PA2) 28(PA4) 41(PE11) 43(PE13) 44(PE14) 45(PE15) 62(PD15) 63(PC6) 64(PC7) 66(PC9) 69(PA10) 77(PA15/JTDI) 84(PD3) 85(PD4) 87(PD6) 88(PD7) 96(PB9) 97(PE0) 98(PE1); U11 1(GND) 2(GND) 3(CPEN) 4(VBUS) 5(ID) 6(VDD3.3) 7(DP) 8(DM) 9(RESET) 10(EXTVBUS) 11(NXT) 12(DIR) 13(STP) 14(CLKOUT) 15(VDD1.8) 16(VDD3.3) 17(DATA7) 18(DATA6) 19(DATA5) 20(DATA4) 21(DATA3) 22(DATA2) 23(DATA1) 24(DATA0) 25(VDD3.3) 26(VDD1.8) 27(XO) 28(XI) 29(VDDA1.8) 30(VDD3.3) 31(REG_EN) 32(RBIAS) 33(EPAD)

### Notes on the sheet
- Подп. дата
- Инв. № дубл.
- Взам. инв. №
- Подп. и дата
- Инв. № подл.
- Изм.
- Лист
- № докум.
- Подп.
- Дата
- ALTIUM GOSTBOM2.0 KEV
- Файл:
- Копировал
- Формат А3

### Library data of the parts
C25-C33 = GRM155R71E104KE14D: as C40 on sheet Power; Part Number: GRM155R71E104KE14D; Value: 100n; Series: GRM; SMD: Yes; Manufacturer Part Number: GRM155R71E104KE14D; Status: Active; Price: 0; Price2: 0; Price3: 0; Author: Krepak V.; CreateDate: 23.02.2020
C34 C35 = GRM155R61A225KE95D: CAP CER 0402 2.2uF 10V X5R; Manufacturer: Murata; ID: 36; Device: 0402; Tolerance: 10%; Type: Resistor; Packaging Type: Cut Tape; Working Temperature Min: -55°С; Working Temperature Max: +85°С; Table: Capacitor SMT - Керамические; Part Number: GRM155R61A225KE95D; Value: 2.2uF; Voltage: 10V; Dielectric Type: X5R; Series: GRM; SMD: Yes; Manufacturer Part Number: GRM155R61A225KE95D; Datasheet URL: #https://search.murata.co.jp/Ceramy/image/img/A01X/G101/ENG/GRM155R61A225KE95-01.pdf#; Status: Active; Price: 0; Price2: 0; Price3: 0; Author: Krepak V.; CreateDate: 31.03.2021
C36 C37 = GRM1555C1H120JA01D: CAP CER 0402 12pF 50V NP0; Manufacturer: Murata; ID: 49; Device: 0402; Tolerance: 5%; Type: Resistor; Packaging Type: Tape&Reel; Working Temperature Min: -55°С; Working Temperature Max: +125°С; Table: Capacitor SMT - Керамические; Part Number: GRM1555C1H120JA01D; Value: 12pF; Voltage: 50V; Dielectric Type: NP0; Series: GRM; SMD: Yes; Manufacturer Part Number: GRM1555C1H120JA01D; Datasheet URL: #https://search.murata.co.jp/Ceramy/image/img/A01X/G101/ENG/GRM1555C1H120JA01-01.pdf#; Status: Not recommended; Price: 0; Price2: 0; Price3: 0; Author: Krepak V.; CreateDate: 22.04.2021; Supplier 1: Digikey; Supplier Part Number 1: 490-5924-2-ND
J2 J19 = DS1021-1*3SF11-B: Manufacturer: CONNFLY; ID: 13; Limit Voltage: 500 V AC(1 min); Resistance: 20 mOhm(max); Pitch: 2.54mm; Working Temperature Min: -20°С; Working Temperature Max: +70°С; Table: Connectors - Общ; Part Number: DS1021-1*3SF11-B; Device: PLS-3; Pins: 3; Type: Connector; SMD: No; Datasheet URL: #https://static.chipdip.ru/lib/227/DOC000227157.pdf#; Status: Active; Price: 0; Price2: 0; Price3: 0; Author: Arshanitsa D.; CreateDate: 19.08.2020
J5 = USB-TYPE-C-019: 1 16P -25℃~+85℃ Type-C SMD USB, DVI, HDMI Connector Assemblies RoHS; MF: Amphenol ICC (Commercial Products); ID: 36; Table: Connectors - Интерфейсы; MP: 12402012E212A; Price: 0; Package: None; Availability: In Stock; SnapEDA_Link: https://www.snapeda.com/parts/12402012E212A/Amphenol/view-part/?ref=snap; Check_prices: https://www.snapeda.com/parts/12402012E212A/Amphenol/view-part/?ref=eda; Purchase-URL: https://pricing.snapeda.com/search/part/12402012E212A/?ref=eda; Part Number: USB-TYPE-C-019; Device: USB-TYPE-C-019; Pins: 16+8; Type: Connector; Price2: 0; Price3: 0
J17 = DS1021-1*5SF11-B: Manufacturer: CONNFLY; ID: 12; Limit Voltage: 500 V AC (1 min); Resistance: 20 mOhm(max); Pitch: 2.54mm; Working Temperature Min: -20; Working Temperature Max: +70°С; Table: Connectors - Общ; Part Number: DS1021-1*5SF11-B; Device: PLS-5; Pins: 5; Type: Connector; SMD: No; Datasheet URL: #https://static.chipdip.ru/lib/227/DOC000227157.pdf#; Status: Active; Price: 0; Price2: 0; Price3: 0; Author: Arshanitsa D.; CreateDate: 09.06.2020
LD1-LD3 = LTST-C191TBKT-5A: DIODE LTST-C191TBKT-5A; ID: 9; Packaging Type: Cut Tape; Table: Diodes SMT - Светодиоды; Part Number: LTST-C191TBKT-5A; Device: LTST-C191TBKT-5A; Value: LTST-C191TBKT-5A; Color: Blue; Type: Diode; SMD: Yes; Manufacturer Part Number: LTST-C191TBKT-5A; Datasheet URL: #https://jlcpcb.com/partdetail/liteon-LTST_C191TBKT5A/C161620#; Status: Active; Price: 0; Price2: 0; Price3: 0; Author: Krepak V.; CreateDate: 18.02.2024
LD5 = GNL-3012GD: DIODE GREEN; Manufacturer: G-NOR OPTOELECTRONICS; ID: 2; Reverse Voltage: 5V; Reverse Current: 10uA; Forward Current: 30mA; Luminous Flux: 7uCd; Number of LEDs: 1; Notes: 565nm 60deg; Packaging Type: Bulk; Table: Diodes THM - Светодиоды; Part Number: GNL-3012GD; Device: GREEN; Color: Green; Series: GNL-3012xx; Type: Diode; SMD: No; Manufacturer Part Number: GNL-3012GD; Datasheet URL: #https://static.chipdip.ru/lib/773/DOC002773602.pdf#; Status: Active; Distributor: chipdip; Price: 0; Price2: 0; Price3: 0; DistributorURL: #https://www.chipdip.ru/product/gnl-3012gd#; Author: Krepak V.; CreateDate: 25.08.2020; LatestRevisionDate: 25.08.2020
PB3 PB4 = FSM6JSMATR: Tactile Switch SPST-NO Top Actuated Surface Mount; Manufacturer: Te Connectivity; ID: 3; Device: TACT; Limit Voltage: 24VDC; Limit Current: 50mA; Working Temperature Min: -35°С; Working Temperature Max: +85°С; Table: Misc - Переключатели Кнопочные; Part Number: FSM6JSMATR; Series: FSMJSM; Type: Misc; SMD: Yes; Manufacturer Part Number: FSM6JSMATR; Datasheet URL: #https://www.terraelectronica.ru/pdf/show?pdf_file=http%253A%252F%252Fwww.farnell.com%252Fcad%252F1922404.pdf#; Status: Active; Distributor: terraelectronica; Price: 0; Price2: 0; Price3: 0; DistributorURL: #https://www.terraelectronica.ru/product/972320#; Author: Krepak V.; CreateDate: 31.08.2020
R26 R28 = RC0603JR-074K7L: RES 0603 4.7k 5%; Manufacturer: Yageo; ID: 29; Limit Voltage: 75V; Temperature Coefficient: 100ppm; Total Power Dissipation: 0.1W; Packaging Type: Cut Tape; Replacement: CR-03JL7---4K7, CRCW06034K70JNEA; Library Ref 2: Resistor2; Library Ref 3: Resistor3; Library Path 2: Resistors.SchLib; Application Category: 1; Working Temperature Min: -55°С; Working Temperature Max: +155°С; Table: Resistor SMT - Постоянные; Part Number: RC0603JR-074K7L; Value: 4.7k; Series: RC; Type: Resistor; Material: Thick-Film; SMD: Yes; Manufacturer Part Number: RC0603JR-074K7L; Datasheet URL: #https://www.terraelectronica.ru/pdf/show?pdf_file=%252Fds%252Fpdf%252FR%252FRC0603%255B1%255D.pdf#; Status: Active; Distributor: terraelectronica; Price: 0; Price2: 0; Price3: 0; DistributorURL: #https://www.terraelectronica.ru/product/540975#; Author: Krepak V.; CreateDate: 06.07.2020
R27 R29 R30 R72 R73 R75 = RC0402FR-07499RL: RES 0402 499 1%; Manufacturer: Yageo; ID: 90; Device: 0402; Limit Voltage: 50V; Temperature Coefficient: 100ppm; Total Power Dissipation: 0.0625W; Packaging Type: Tape&Reel; Library Ref 2: Resistor2; Library Ref 3: Resistor3; Library Path 2: Resistors.SchLib; Application Category: 1; Working Temperature Min: -55°С; Working Temperature Max: +155°С; Table: Resistor SMT - Постоянные; Part Number: RC0402FR-07499RL; Value: 499; Tolerance: 1%; Series: RC_L; Type: Resistor; Material: Thick-Film; SMD: Yes; Manufacturer Part Number: RC0402FR-07499RL; Datasheet URL: #https://www.yageo.com/upload/media/product/productsearch/datasheet/rchip/PYu-RC_Group_51_RoHS_L_11.pdf#; Status: Active; Distributor2: Jul. 7, 2020 V.11; Price: 0; Price2: 0; Price3: 0; Author: Krepak V.; CreateDate: 01.02.2022; Supplier 1: Digikey; Supplier Part Number 1: 311-499LRTR-ND
R31 = RC0402FR-07100KL: as R39 on sheet Power; Part Number: RC0402FR-07100KL; Value: 100k; Tolerance: 1%; Series: RC; Type: Resistor; Material: Thick-Film; SMD: Yes; Price: 0; Price2: 0; Price3: 0; Author: Krepak V.; CreateDate: 23.02.2020
U3 = STM32F765VGT6: ARM® Cortex®-M7 STM32F7 Microcontroller IC 32-Bit Single-Core 216MHz 1MB (1M x 8) FLASH 100-LQFP (14x14); Manufacturer: ST Microelectronics; MF: STMicroelectronics; MP: STM32F765VGT6TR; ID: 12; Supply Operation: 1.7V ~ 3.6V; SRAM: 512K x 8; Prog Interface: SWD, JTAG; I/O Lines: 82; Packaging Type: Tape&Reel; Working Temperature Min: -40°С; Working Temperature Max: +85°С; Table: IC - Микроконтроллеры; Package: LQFP-100 STMicroelectronics; Price: 0; Check_prices: https://www.snapeda.com/parts/STM32F765VGT6TR/STMicroelectronics/view-part/?ref=eda; Value: 100-LQFP; SnapEDA_Link: https://www.snapeda.com/parts/STM32F765VGT6TR/STMicroelectronics/view-part/?ref=snap; Availability: In Stock; Purchase-URL: https://pricing.snapeda.com/search?q=STM32F765VGT6TR&ref=eda; Part Number: STM32F765VGT6; Device: STM32F765VGT6; Series: STM32F7; Flash: 1MB (1M x 8); Operation Frequency: 216MHz; Type: IC; SMD: Yes; Manufacturer Part Number: STM32F765VGT6; Datasheet URL: #https://www.st.com/resource/en/datasheet/stm32f765vg.pdf#; Datasheet Version: August 2023; Status: Active; Price2: 0; Price3: 0; Author: Krepak V.; CreateDate: 04.04.2024
U11 = USB3300-EZK: USB Controller USB 2.0, OTG ULPI Interface 32-QFN (5x5); Manufacturer_Name: Microchip; Manufacturer: Microchip Technology; ID: 30; Supply Operation: 3V ~ 3.6V; Working Temperature Min: -40°С; Working Temperature Max: +85°С; Table: IC - Микросхемы интерфейсов; Copyright: Copyright (C) 2025 Ultra Librarian. All rights reserved.; Manufacturer_Part_Number: USB3300-EZK; RefDes: RefDes; Type: IC; Part Number: USB3300-EZK; Device: USB3300-EZK; Value: 32-QFN (5x5); Protocol: USB 2.0, OTG; SMD: Yes; Manufacturer Part Number: USB3300-EZK; Status: Active; Price: 0; Price2: 0; Price3: 0; Author: Krepak V.; CreateDate: 01.12.2025; Supplier 1: Digikey; Supplier Part Number 1: 638-1034-ND
X1 = CSTCE8M00G55-R0: 8MHz ±0.5% 33pF SMD3213-3P Ceramic Resonators ROHS; Manufacturer: Murata; Frequency Stability: 0.2%; ID: 10; Device: Crystal; Packaging Type: Tape&Reel; Working Temperature Min: -40°С; Working Temperature Max: +125°С; Table: Crystal SMT - Кварцевые Резонаторы; Datasheet Version: Mar.17,2015; Capacitance: 33pF; RoHSCompliant: True; Datasheet URL: #https://jlcpcb.com/partdetail/MurataElectronics-CSTCE8M00G55R0/C70457#; Case/Package: Ceramic; Load Capacitance: 33pF; Tolerance: 0.5%; Self Resonant Frequency: 8MHz; Mount: SurfaceMount; Height: 0.031inch; Number of Pins: 3; Package Description: 3-Pin Surface Mount Device, Body 3.2 x 1.3 mm, Pitch 1.2 mm; Package Quantity: 1; Lead Free: LeadFree; Contact Plating: Gold; REACH SVHC: NoSVHC; Length: 0.126inch; Width: 0.051inch; Manufacturer URL: http://www.murata.com/; Packaging: TapeandReel; Termination: SMD/SMT; Frequency Tolerance: 0.5%; Max Operating Temperature: 80degC; Composition: Ceramic; Package Reference: CSTCE_G_A-3; Min Operating Temperature: -20degC; Frequency: 8MHz; Part Number: CSTCE8M00G55-R0; Output Frequency: 8MHz; Temperature Coefficient: ±0.5%; Type: Crystal; SMD: Yes; Manufacturer Part Number: CSTCE8M00G55-R0; Status: Active; Price: 0; Price2: 0; Price3: 0; Author: Krepak V.; CreateDate: 21.02.2024
ZQ1 = ABS05-32.768kHz-T: 32.768kHz 12.5pF ±20ppm SMD1610-2P Crystals ROHS; Manufacturer: Abracon; ID: 9; Packaging Type: Tape&Reel; Working Temperature Min: -40°С; Working Temperature Max: +85°С; Table: Crystal SMT - Кварцевые Резонаторы; Device: Crystal; Output Frequency: 32.768kHz; Load Capacitance: 12.5pF; Type: Crystal; SMD: Yes; Manufacturer Part Number: ABS05-32.768kHz-T; Datasheet URL: #https://jlcpcb.com/partdetail/AbraconLlc-ABS05_32_768kHzT/C179633#; Datasheet Version: Revised: 06.03.15; Status: Active; Price: 0; Price2: 0; Price3: 0; Author: Krepak V.; CreateDate: 21.02.2024

## Sheet WiFi.SchDoc: riglab_dynamic_scales_wifi_3ch
size 420 x 297 mm; DocumentNumber: 5; SheetNumber: 5; SheetTotal: 5; Обозначение_Код: RIG-00.00.001 Э3
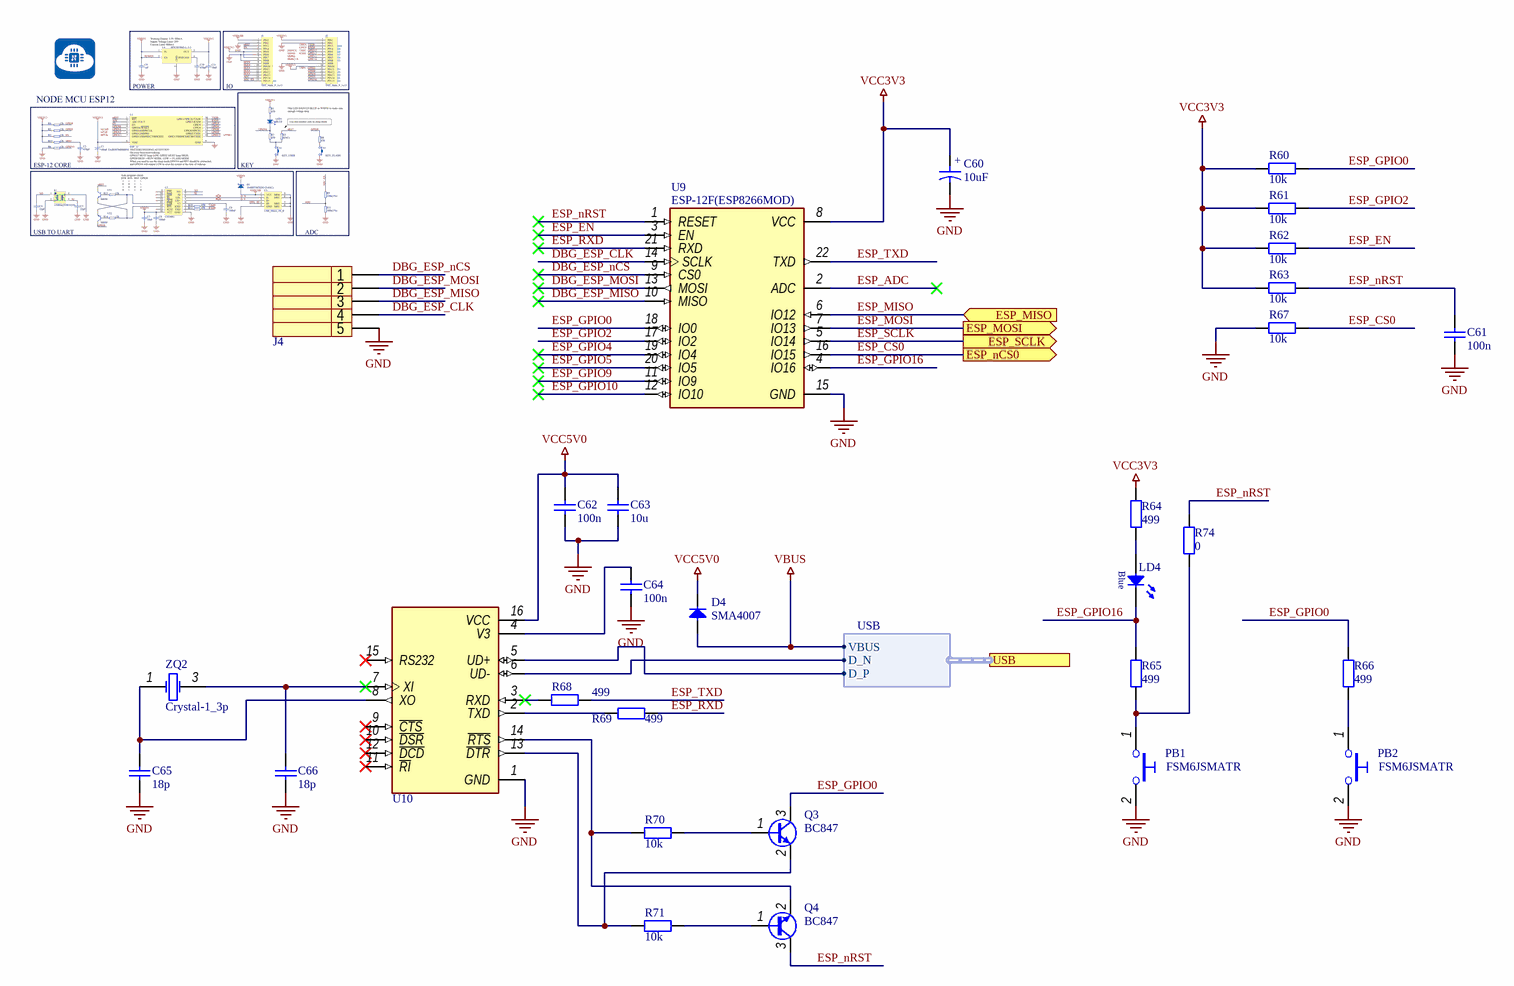
[diagram p3: WiFi.SchDoc]

### Parts
C60  10uF  [CAPPM7343X310N]
C61  100n  [CAPC1005X55N]
C62  100n  [CAPC1005X55N]
C63  10u  [CAPC2012X135N]
C64  100n  [CAPC1005X55N]
C65  18p  [CAPC1005X55N]
C66  18p  [CAPC1005X55N]
D4  SMA4007  [DO-214AC]
J4  DS1021-1*5SF11-B  [PLS-5]  (value not drawn)
LD4  Blue  [0603(LED)]  (value not drawn)
PB1  FSM6JSMATR  [FSMxJSMA-Series]
PB2  FSM6JSMATR  [FSMxJSMA-Series]
Q3  BC847  [SOT95P240X130-3N]
Q4  BC847  [SOT95P240X130-3N]
R60  10k  [RESC1005X40N]
R61  10k  [RESC1005X40N]
R62  10k  [RESC1005X40N]
R63  10k  [RESC1005X40N]
R64  499  [RESC1005X40N]
R65  499  [RESC1005X40N]
R66  499  [RESC1005X40N]
R67  10k  [RESC1005X40N]
R68  499  [RESC1005X40N]
R69  499  [RESC1005X40N]
R70  10k  [RESC1005X40N]
R71  10k  [RESC1005X40N]
R74  0  [RESC1608X50N]
U9  ESP-12F(ESP8266MOD)  [XCVR_ESP8266-12E/ESP-12E]
U10  CH340G  [SOIC127P600X180-16N]  (value not drawn)
ZQ2  Crystal-1_3p  [SMD 3.2x2.5mm]

### Ports
ESP_MISO (in), ESP_MOSI (out), ESP_nCS0 (out), ESP_SCLK (out), USB (harness USB)

### Harnesses
USB: D_N, D_P, VBUS

### Nets
GND: C60.2 C61.1 C62.1 C63.1 C64.1 C65.1 C66.1 J4.5 PB1.2 PB2.2 R67.1 U9.15(GND) U10.1(GND)
VBUS: D4.1(A) ; port USB.VBUS
VCC3V3: C60.1 R60.1 R61.1 R62.1 R63.1 R64.2 U9.8(VCC)
VCC5V0: C62.2 C63.2 D4.2(C) U10.16(VCC)
D_N: U10.6(UD-) ; port USB.D_N
D_P: U10.5(UD+) ; port USB.D_P
DBG_ESP_CLK: J4.4 U9.14(SCLK)
DBG_ESP_MISO: J4.3 U9.10(MISO)
DBG_ESP_MOSI: J4.2 U9.13(MOSI)
DBG_ESP_nCS: J4.1 U9.9(CS0)
ESP_ADC: U9.2(ADC)
ESP_CS0: R67.2 U9.16(IO15) ; port ESP_nCS0
ESP_EN: R62.2 U9.3(EN)
ESP_GPIO0: Q3.3(C) R60.2 R66.2 U9.18(IO0)
ESP_GPIO2: R61.2 U9.17(IO2)
ESP_GPIO4: U9.19(IO4)
ESP_GPIO5: U9.20(IO5)
ESP_GPIO9: U9.11(IO9)
ESP_GPIO10: U9.12(IO10)
ESP_GPIO16: LD4.2(C) R65.1 U9.4(IO16)
ESP_MISO: U9.6(IO12) ; port ESP_MISO
ESP_MOSI: U9.7(IO13) ; port ESP_MOSI
ESP_nRST: C61.2 Q4.3(C) R63.2 R74.1 U9.1(RESET)
ESP_RXD: R69.2 U9.21(RXD)
ESP_SCLK: U9.5(IO14) ; port ESP_SCLK
ESP_TXD: R68.2 U9.22(TXD)
NetC64_2: C64.2 U10.4(V3)
NetC65_2: C65.2 U10.8(XO) ZQ2.1(OSC1)
NetC66_2: C66.2 U10.7(XI) ZQ2.3(OSC2)
NetLD4_1: LD4.1(A) R64.1
NetPB1_1: PB1.1 R65.2 R74.2
NetPB2_1: PB2.1 R66.1
NetQ3_1: Q3.1(B) R70.2
NetQ3_2: Q3.2(E) R71.1 U10.13(~{DTR})
NetQ4_1: Q4.1(B) R71.2
NetQ4_2: Q4.2(E) R70.1 U10.14(~{RTS})
NetR68_1: R68.1 U10.3(RXD)
NetR69_1: R69.1 U10.2(TXD)

Not connected (* = marked no-connect by the designer): U10 9(~{CTS})* 10(~{DSR})* 11(~{RI})* 12(~{DCD})* 15(RS232)*

### Notes on the sheet
- Подп. дата
- Инв. № дубл.
- Взам. инв. №
- Подп. и дата
- Инв. № подл.
- Изм.
- Лист
- № докум.
- Подп.
- Дата
- ALTIUM GOSTBOM2.0 KEV
- Файл:
- Копировал
- Формат А3
- (in symbol T491D106K035AT) +

### Library data of the parts
C60 = T491D106K035AT: CAP TANT T491D106K035AT 10uF 35V Tantalum; Manufacturer: KEMET; ID: 2; Tolerance: ±10%; Type: Resistor; Packaging Type: Cut Tape; Working Temperature Min: -55°C; Working Temperature Max: +125°C; Table: Capacitor SMT - Электролитические; Part Number: T491D106K035AT; Device: T491D106K035AT; Value: 10uF; Voltage: 35V; Dielectric Type: Tantalum; Series: T491; SMD: Yes; Manufacturer Part Number: T491D106K035AT; Datasheet URL: #https://datasheet.lcsc.com/lcsc/2304140030_KEMET-T491D106K035AT_C122299.pdf#; Status: Active; Price: 0; Price2: 0; Price3: 0; Author: Krepak V.; CreateDate: 20.02.2024
C61 = GRM155R71C104KA88D: CAP CER 0402 100n 16V X7R; Manufacturer: Murata; ID: 3; Device: 0402; Tolerance: 10%; Type: Resistor; Packaging Type: Cut Tape; Working Temperature Min: -55°С; Working Temperature Max: +125°С; Table: Capacitor SMT - Керамические; Part Number: GRM155R71C104KA88D; Value: 100n; Voltage: 16V; Dielectric Type: X7R; Series: GRM; SMD: Yes; Manufacturer Part Number: GRM155R71C104KA88D; Status: Active; Price: 0; Price2: 0; Price3: 0; Author: Krepak V.; CreateDate: 23.02.2020
C62 C64 = GRM155R71E104KE14D: as C51 on sheet Power; Part Number: GRM155R71E104KE14D; Value: 100n; Voltage: 25V; Dielectric Type: X7R; Series: GRM; SMD: Yes; Manufacturer Part Number: GRM155R71E104KE14D; Status: Active; Price: 0; Price2: 0; Price3: 0; Author: Krepak V.; CreateDate: 23.02.2020
C63 = GRM21BZ71E106KE15L: as C49 on sheet Power; Part Number: GRM21BZ71E106KE15L; Value: 10u; Voltage: 25V; Dielectric Type: X7R; Series: GRM; SMD: Yes; Manufacturer Part Number: GRM21BZ71E106KE15L; Status: Active; Price: 0; Price2: 0; Price3: 0; Author: Krepak V.; CreateDate: 23.02.2020
C65 C66 = C0402C180K5RACTU: CAP CER 0402 18p 50V X7R; Manufacturer: Kemet; Manufacturer Part Number: C0402C180K5RAC7867; ID: 9; Device: 0402; Tolerance: 10%; Type: Resistor; Packaging Type: Cut Tape; Working Temperature Min: -55°С; Working Temperature Max: +125°С; Table: Capacitor SMT - Керамические; Part Number: C0402C180K5RACTU; Value: 18p; Voltage: 50V; Dielectric Type: X7R; Series: C Series KEMET; SMD: Yes; Status: Active; Price: 0; Price2: 0; Price3: 0; Author: Krepak V.; CreateDate: 25.02.2020
D4 = SMA4007: as D3 on sheet Power; Part Number: SMA4007; Device: SMA4007; Type: Diode; SMD: Yes; Manufacturer Part Number: SMA4007; ComponentHeight: 0.96mm; Datasheet URL: #http://pdf.datasheet.live/c12a47ed/wingshing.com/SMA4007.pdf#; Status: Active; Distributor: Chipdip; Price: 0; Price2: 0; Price3: 0; DistributorURL: #https://www.chipdip.ru/product/sma4007#; Author: Krepak V.; CreateDate: 24.06.2020; LatestRevisionDate: 24.06.2020
J4 = DS1021-1*5SF11-B: as J17 on sheet MCU; Part Number: DS1021-1*5SF11-B; Device: PLS-5; Pins: 5; Type: Connector; SMD: No; Datasheet URL: #https://static.chipdip.ru/lib/227/DOC000227157.pdf#; Status: Active; Price: 0; Price2: 0; Price3: 0; Author: Arshanitsa D.; CreateDate: 09.06.2020
LD4 = TO-1608BC-BF: DIODE TO-1608BC-BF; Manufacturer Part Number: 9201T055; ID: 1; Packaging Type: Cut Tape; Table: Diodes SMT - Светодиоды; Part Number: TO-1608BC-BF; Device: TO-1608BC-BF; Value: TO-1608BC-BF; Color: Blue; Type: Diode; SMD: Yes; Datasheet URL: #https://static.chipdip.ru/lib/736/DOC002736042.pdf#; Price: 0; Price2: 0; Price3: 0; Author: Arshanitsa D.; CreateDate: 28.06.2020
PB1 PB2 = FSM6JSMATR: as PB3 on sheet MCU; Part Number: FSM6JSMATR; Series: FSMJSM; Type: Misc; SMD: Yes; Manufacturer Part Number: FSM6JSMATR; Datasheet URL: #https://www.terraelectronica.ru/pdf/show?pdf_file=http%253A%252F%252Fwww.farnell.com%252Fcad%252F1922404.pdf#; Status: Active; Distributor: terraelectronica; Price: 0; Price2: 0; Price3: 0; DistributorURL: #https://www.terraelectronica.ru/product/972320#; Author: Krepak V.; CreateDate: 31.08.2020
Q3 Q4 = BC847,215: Bipolar (BJT) Transistor NPN 45V 100mA 100MHz 250mW Surface Mount TO-236AB; Manufacturer: Nexperia; ID: 3; Vce Saturation: 400mV @ 5mA, 100mA; Collector Current Cutoff: 15nA (ICBO); DC Current Gain (Min): 110 @ 2mA, 5V; Packaging Type: Tape&Reel; Working Temperature Min: -40°С; Working Temperature Max: +150°С (JT); Table: Transistor SMT - BJT; Part Number: BC847,215; Device: NPN; Series: Automotive, AEC-Q101; Max Collector Current: 100mA; Vce Breakdown: 45V; Total Power Dissipation: 250mW; Frequency - Transition: 100MHz; Type: Transistor; SMD: Yes; Manufacturer Part Number: BC847,215; Datasheet URL: #https://static.chipdip.ru/lib/583/DOC001583029.pdf#; Datasheet Version: Rev. 9 — 23 September 2014; Status: Active; Price: 0; Price2: 0; Price3: 0; Author: Krepak V.; CreateDate: 18.08.2020; LatestRevisionDate: 18.08.2020; Supplier 1: Digikey; Supplier Part Number 1: 1727-4855-2-ND
R60-R63 R67 R70 R71 = RC0402FR-0710KL: RES 0402 10k 1%; Manufacturer: Yageo; ID: 9; Device: 0402; Limit Voltage: 50V; Temperature Coefficient: 100ppm; Total Power Dissipation: 0.0625W; Packaging Type: Cut Tape; Replacement: CR-02FL6---10K; Library Ref 2: Resistor2; Library Ref 3: Resistor3; Library Path 2: Resistors.SchLib; Application Category: 1; Working Temperature Min: -55°С; Working Temperature Max: +155°С; Table: Resistor SMT - Постоянные; Part Number: RC0402FR-0710KL; Value: 10k; Tolerance: 1%; Series: RC; Type: Resistor; Material: Thick-Film; SMD: Yes; Manufacturer Part Number: RC0402FR-0710KL; Datasheet URL: #https://www.terraelectronica.ru/pdf/show?pdf_file=%252Fds%252Fpdf%252FR%252FRC0402.pdf#; Price: 0; Price2: 0; Price3: 0; Author: Krepak V.; CreateDate: 26.02.2020
R64-R66 R68 R69 = RC0402FR-07499RL: as R27 on sheet MCU; Part Number: RC0402FR-07499RL; Value: 499; Tolerance: 1%; Series: RC_L; Type: Resistor; Material: Thick-Film; SMD: Yes; Manufacturer Part Number: RC0402FR-07499RL; Datasheet URL: #https://www.yageo.com/upload/media/product/productsearch/datasheet/rchip/PYu-RC_Group_51_RoHS_L_11.pdf#; Status: Active; Distributor2: Jul. 7, 2020 V.11; Price: 0; Price2: 0; Price3: 0; Author: Krepak V.; CreateDate: 01.02.2022; Supplier 1: Digikey; Supplier Part Number 1: 311-499LRTR-ND
R74 = RC0603JR-070RL: as R32 on sheet Power; Part Number: RC0603JR-070RL; Value: 0; Tolerance: 5%; Series: RC; Type: Resistor; Material: Thick-Film; SMD: Yes; Manufacturer Part Number: RC0603JR-070RL; Datasheet URL: #https://static.chipdip.ru/lib/788/DOC004788200.pdf#; Status: Active; Price: 0; Price2: 0; Price3: 0; Author: Arshanitsa D.; CreateDate: 28.06.2020
U9 = ESP8266MOD: -90dBm 16dBm ESP8266芯片 板载PCBAntenna 2.4GHz SMD,16x24mm WiFi Modules ROHS; MF: AI-Thinker; ID: 10; Working Temperature Min: -40°С; Working Temperature Max: +85°С; Table: Modules - Радиотрансиверы; SnapEDA_Link: https://www.snapeda.com/parts/ESP8266-12E/ESP-12E/AI-Thinker/view-part/?ref=snap; Availability: Not in stock; Price: 0; Package: None; Check_prices: https://www.snapeda.com/parts/ESP8266-12E/ESP-12E/AI-Thinker/view-part/?ref=eda; MP: ESP8266-12E/ESP-12E; Part Number: ESP8266MOD; Device: ESP-12F(ESP8266MOD); RF Family/Standard: WiFi; Type: Misc; SMD: Yes; Status: Active; Price2: 0; Price3: 0; Author: Krepak V.; CreateDate: 04.04.2024
U10 = CH340G: 2Mbps Transceiver USB 2.0 SOP-16 USB ICs ROHS; MF: WCH; ID: 29; Table: IC - Микросхемы интерфейсов; SnapEDA_Link: https://www.snapeda.com/parts/Ch340G/WCH/view-part/?ref=snap; MP: Ch340G; Check_prices: https://www.snapeda.com/parts/Ch340G/WCH/view-part/?ref=eda; Availability: Not in stock; Price: 0; Package: None; Part Number: CH340G; Device: CH340G; Type: IC; SMD: Yes; Price2: 0; Price3: 0; Author: Krepak V.; CreateDate: 05.04.2024
ZQ2 = KX-7 16.0 MHz: Кварцевый резонатор 16.0МГц в корпусе SMD. Размер 3,2х2,5х1,2, Температурный диапазон: -20/+70С Стабильность частоты +/- 30ррm.; ID: 1; Output Frequency: 16MHz; Table: Crystal SMT - Кварцевые Резонаторы; Part Number: KX-7 16.0 MHz; Type: Crystal; SMD: Yes; Distributor: terraelectronica; Price: 0; Price2: 0; Price3: 0; DistributorURL: #https://www.terraelectronica.ru/product/165772#